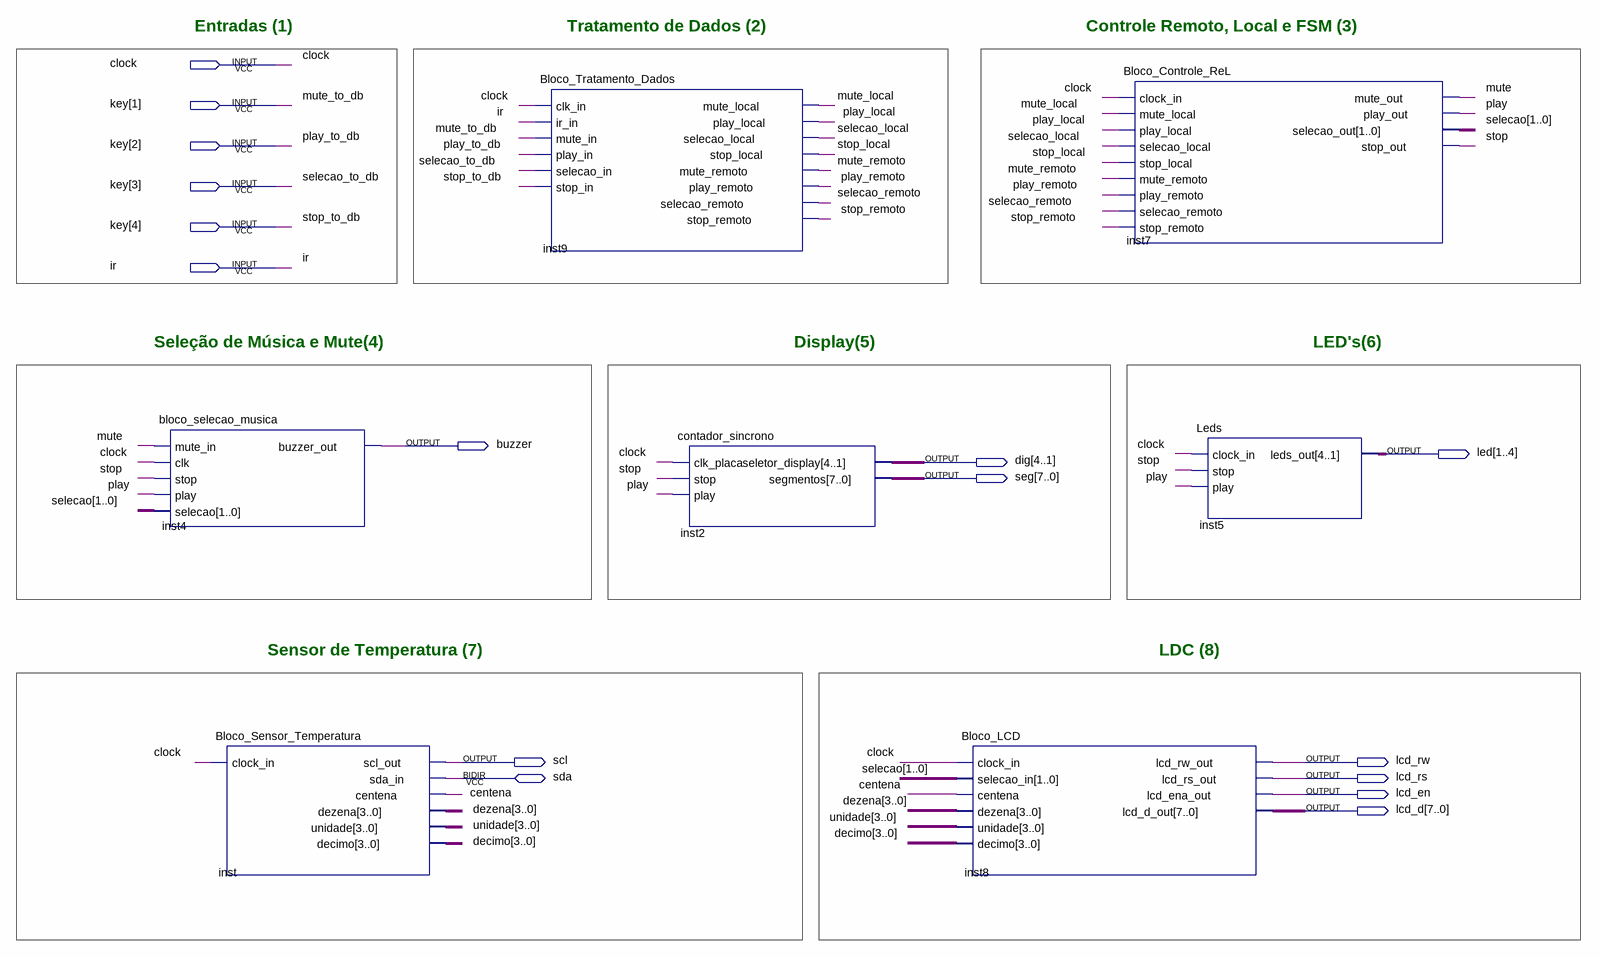
[diagram p0: schematic sheet]
// Quartus schematic Bloco_Topo_Nivel.bdf as structural Verilog: 7 symbols, 16 pins
module Bloco_Topo_Nivel (
  input  clock,
  input  [4:1] key,
  input  ir,
  inout  sda,
  output buzzer,
  output [1:4] led,
  output [4:1] dig,
  output [7:0] seg,
  output scl,
  output lcd_rw,
  output lcd_rs,
  output lcd_en,
  output [7:0] lcd_d
);

  wire centena, mute, mute_local, mute_remoto, play, play_local, play_remoto, selecao_local, selecao_remoto,
       stop, stop_local, stop_remoto;
  wire [1:0] selecao;
  wire [3:0] decimo, dezena, unidade;

  bloco_selecao_musica inst4 (
    .mute_in(mute), .clk(clock), .stop(stop), .play(play), .selecao(selecao), .buzzer_out(buzzer));
  Bloco_Sensor_Temperatura inst (
    .clock_in(clock), .scl_out(scl), .centena(centena), .dezena(dezena), .unidade(unidade), .decimo(decimo),
    .sda_in(sda));
  Bloco_Tratamento_Dados inst9 (
    .clk_in(clock), .ir_in(ir), .mute_in(key[1]), .play_in(key[2]), .selecao_in(key[3]), .stop_in(key[4]),
    .mute_local(mute_local), .play_local(play_local), .selecao_local(selecao_local), .stop_local(stop_local),
    .mute_remoto(mute_remoto), .play_remoto(play_remoto), .selecao_remoto(selecao_remoto),
    .stop_remoto(stop_remoto));
  contador_sincrono inst2 (.clk_placa(clock), .stop(stop), .play(play), .seletor_display(dig), .segmentos(seg));
  Bloco_LCD inst8 (
    .clock_in(clock), .selecao_in(selecao), .centena(centena), .dezena(dezena), .unidade(unidade),
    .decimo(decimo), .lcd_rw_out(lcd_rw), .lcd_rs_out(lcd_rs), .lcd_ena_out(lcd_en), .lcd_d_out(lcd_d));
  Bloco_Controle_ReL inst7 (
    .clock_in(clock), .mute_local(mute_local), .play_local(play_local), .selecao_local(selecao_local),
    .stop_local(stop_local), .mute_remoto(mute_remoto), .play_remoto(play_remoto),
    .selecao_remoto(selecao_remoto), .stop_remoto(stop_remoto), .mute_out(mute), .play_out(play),
    .selecao_out(selecao), .stop_out(stop));
  Leds inst5 (.clock_in(clock), .stop(stop), .play(play), .leds_out(led));

  // Other names for the same wires on the sheet: mute_to_db = key[1]; play_to_db = key[2]; selecao_to_db = key[3];
  //   stop_to_db = key[4]

  // Notes on the sheet:
  //   Entradas (1)
  //   Tratamento de Dados (2)
  //   Controle Remoto, Local e FSM (3)
  //   Seleção de Música e Mute(4)
  //   Display(5)
  //   LED's(6)
  //   Sensor de Temperatura (7)
  //   LDC (8)
endmodule
